# EAGLE design main (EAGLE 7.2.0)
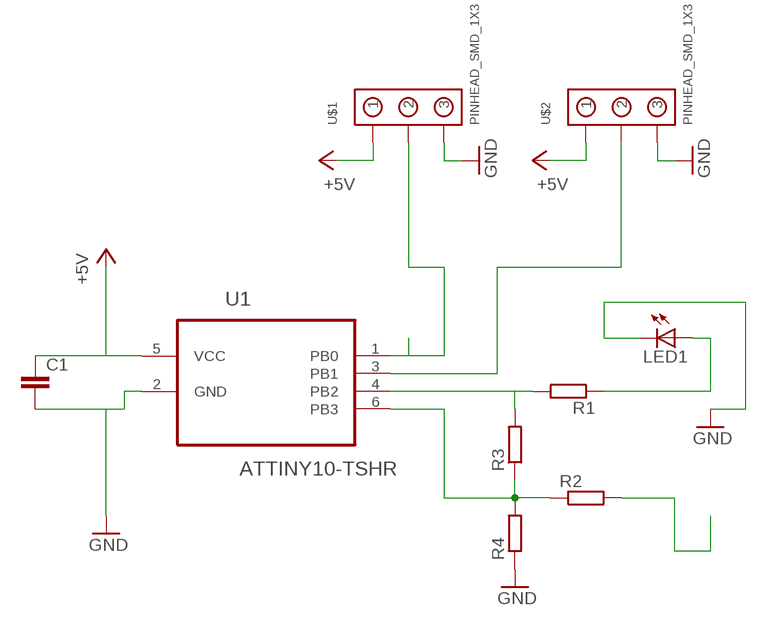
[diagram p0: schematic, sheet 1]

## Parts
C1  C-EUC0805K  [C0805K]
LED1  LED_LEDP-LCC-2-BACK  [LED_HOLE_4MM]
R1  R-EU_R0603  [R0603]
R2  R-EU_R0603  [R0603]
R3  R-EU_R0603  [R0603]
R4  R-EU_R0603  [R0603]
U1  ATTINY10-TSHR  [SOT95P280X145-6N]
U$1  PINHEAD_SMD_1X3  [PINHEAD_1X3]
U$2  PINHEAD_SMD_1X3  [PINHEAD_1X3]

## Nets
+5V: C1.1 U1.5(VCC) U$1.P$1 U$2.P$1
GND: C1.2 LED1.C R4.1 U1.2(GND) U$1.P$3 U$2.P$3
N$1: LED1.A R1.1
N$3: R1.2 R3.2 U1.4(PB2)
N$5: U1.3(PB1) U$2.P$2
N$6: U1.1(PB0) U$1.P$2
N$10: R2.1 R3.1 R4.2 U1.6(PB3)
TOUCH_PAD: R2.2

## Library data of the parts
C1 = custom:C-EU: CAPACITOR, European symbol
LED1 = custom:LED_LED: LED OSRAM: - CHIPLED LG R971, LG N971, LY N971, LG Q971, LY Q971, LO R971, LY R971 LH N974, LH R974 LS Q976, LO Q976, LY Q976 LO Q996 - Hyper CHIPLED LW Q18S LB Q993, LB Q99A, LB R99A - SideLED LS A670, LO A670, LY A670, LG A670, LP A670 LB A673, LV A673, LT A673, LW A673 LH A674 LY A675 LS A676, LA A676, LO A676, LY A676, LW A676 LS A679, LY A679, LG A679 - Hyper Micro SIDELED® LS Y876, LA Y876, LO Y876, LY Y876 LT Y87S - SmartLED LW L88C, LW L88S LB L89C, LB L89S, LG L890 LS L89K, LO L89K, LY L89K LS L896, LA L896, LO L896, LY L896 - TOPLED LS T670, LO T670, LY T670, LG T670, LP T670 LSG T670, LSP T670, LSY T670, LOP T670, LYG T670 LG T671, LOG T671, LSG T671 LB T673, LV T673, LT T673, LW T673 LH T674 LS T676, LA T676, LO T676, LY T676, LB T676, LH T676, LSB T676, LW T676 LB T67C, LV T67C, LT T67C, LS T67K, LO T67K, LY T67K, LW E67C LS E67B, LA E67B, LO E67B, LY E67B, LB E67C, LV E67C, LT E67C LW T67C LS T679, LY T679, LG T679 LS T770, LO T770, LY T770, LG T770, LP T770 LB T773, LV T773, LT T773, LW T773 LH T774 LS E675, LA E675, LY E675, LS T675 LS T776, LA T776, LO T776, LY T776, LB T776 LHGB T686 LT T68C, LB T68C - Hyper Mini TOPLED® LB M676 - Mini TOPLED Santana® LG M470 LS M47K, LO M47K, LY M47K Source: http://www.osram.convergy.de/
R1-R4 = rcl:R-EU_: RESISTOR, European symbol
U1 = Atmel_By_element14_Batch_1-00:ATTINY10-TSHR: 8-bit Microcontroller with In-System Programmable Flash; MPN: ATTINY10-TSHR; OC_FARNELL: 1748538; OC_NEWARK: 26R5645; PACKAGE: SOT-23-6; SUPPLIER: Atmel
U$1 U$2 = custom:PINHEAD_SMD_1X3

## Board
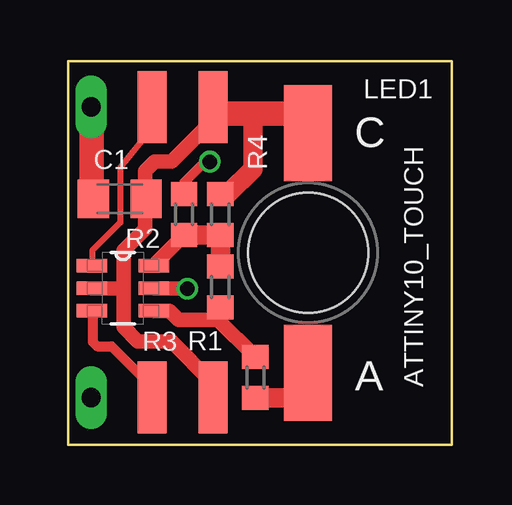
[diagram p1: board, top side]
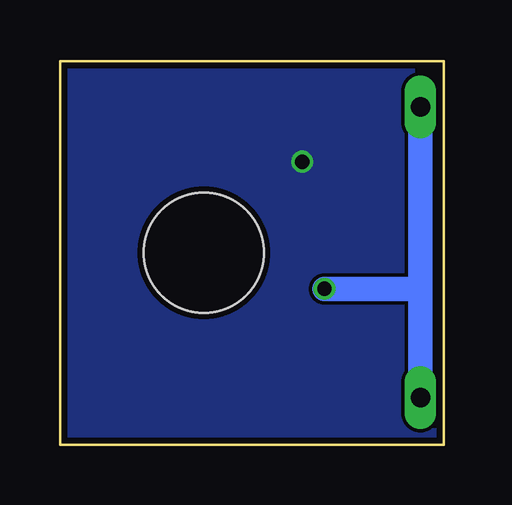
[diagram p2: board, bottom side, seen from below]

Size 16 x 16 mm. Coordinates in mm from the lower left corner, seen from the top.
Outline: 0,0 0,16 16,16 16,0 0,0
Copper layers (1*16): Top 0.035mm / dielectric 1.5mm / Bottom 0.035mm
Design rules "SeeedStudio_2layer_DRU_no_angle_20140221": minimum track width 6mil, minimum drill 12mil, track to track 6mil, track to pad 6mil, pad to pad 6mil, via to via 6mil, smd to smd 0mil, copper to edge 10mil, drill to drill 10mil, minimum pad ring 10mil, minimum via ring 6mil, stop-mask expansion 2mil, vias tented up to drill 100mil, thermal gap 10mil

### Footprints (pad centres in the part's own frame; a part is rotated, then mirrored left to right if it is on the bottom)
C0805K = smd 1.3 x 1.6: 1 -1.1,0; 2 1.1,0
LED_HOLE_4MM = smd 2 x 4: A 0,5; C 0,-5 | hole 5: 0,0
R0603 = smd 1 x 1.1: 1 -0.85,0; 2 0.85,0
SOT95P280X145-6N = smd 1.27 x 0.559: 1 -1.295,0.94; 2 -1.295,0; 3 -1.295,-0.94; 4 1.295,-0.94; 5 1.295,0; 6 1.295,0.94
PINHEAD_1X3 = drill 0.8 pad 1.27 long: P$1 -2.54,0 | smd 1.2 x 3: P$2 0,0; P$3 2.54,0

### Placement (x,y rotation side)
C1  2.15,10.25 0 top
LED1  10,8 180 top
R1  7.8,2.8 90 top
R2  4.83,9.6 90 top
R3  6.34,6.57 270 top
R4  6.34,9.6 270 top
U1  2.28,6.52 0 top
U$1  3.5,14.08 0 top
U$2  3.5,1.96 0 top

### Tracks (layer width: path | path; a pad name or v marks a point on that pad's centre or on a via)
+5V  (via drill 0.6 pad 0.25)
  Top 0.61: U1.5 4.95,6.52 v4.97,6.5
  Top 1.016: U$1.P$1 0.98,14.05 0.98,10.41 C1.1
  Bottom 1.016: U$1.P$1 0.96,6.4 | 0.96,6.4 U$2.P$1 | v4.97,6.5 1.06,6.5 0.96,6.4
GND
  Top 0.406: 5.8,13.3 5.8,13.74 U$1.P$3 | LED1.C 10,13.3 10.2,13.5 LED1.C | LED1.C 9.7,13.8
  Top 0.61: 5.8,13.3 4.3,11.8 3.6,11.8 3.2,11.4 3.2,10.2 | 7.7,13.6 7.9,13.8 | 3.2,10.2 C1.2 | 3.2,10.2 3.2,9 2.3,8.1 2.3,6.4 | 2.3,6.4 2.3,4.9 2.9,4.3 4.3,4.3 6,2.6 6,2 U$2.P$3 | U1.2 2.18,6.52 2.3,6.4
  Top 0.813: R4.1 6.65,10.45 7.7,11.5 7.7,13.6
  Top 1.016: 9.7,13.8 7.9,13.8 6.32,13.8 U$1.P$3
N$1
  Top 0.813: R1.1 9.85,1.95 10,1.8 LED1.A
N$3
  Top 0.406: 6.14,5.58 R3.2
  Top 0.61: R3.2 6.2,5.48 6.2,5.25 | 6.2,5.25 R1.2 | U1.4 4.22,5.58 4.6,5.2 6.15,5.2 6.2,5.25
N$5
  Top 0.406: U1.3 1.02,5.58 1.02,4.28 1.2,4.1 1.8,4.1 3.1,2.8 3.3,2.8 3.6,2.5 | 3.6,3 3.6,2.5 | 3.6,2.5 3.6,2.06 U$2.P$2
N$6
  Top 0.254: U$1.P$2 3.5,13.2 2.17,11.56 2.17,9.26 1,8.1 1,7.47 U1.1
N$10
  Top 0.406: 3.62,7.41 U1.6
  Top 0.61: U1.6 3.58,7.5 R2.1
  Top 0.813: R3.1 R4.2 R2.1 4.83,8.71
TOUCH_PAD  (via drill 0.6 pad 0.25)
  Top 0.406: R2.2 4.83,10.93 5.7,11.8 v5.9,11.8
  pour Bottom: 0,0 0,16 16,16 16,0

### Text on the board
tNames: ATTINY10_TOUCH